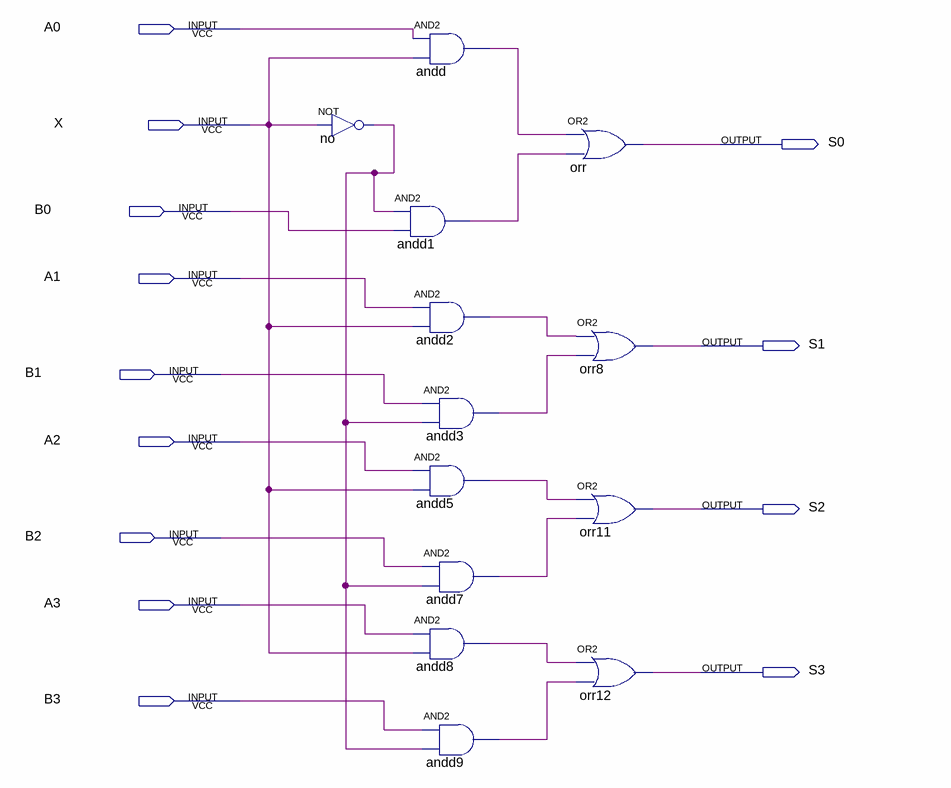
[diagram p0: schematic sheet]
// Quartus schematic MUX8ENTR.bdf as structural Verilog: 13 symbols, 13 pins
module MUX8ENTR (
  input  A0,
  input  X,
  input  B0,
  input  A1,
  input  B1,
  input  A2,
  input  B2,
  input  A3,
  input  B3,
  output S0,
  output S1,
  output S2,
  output S3
);

  wire andd1_out, andd2_out, andd3_out, andd5_out, andd7_out, andd8_out, andd9_out, andd_out, no_out;

  not no (no_out, X);
  and andd (andd_out, A0, X);
  and andd1 (andd1_out, no_out, B0);
  and andd2 (andd2_out, A1, X);
  and andd3 (andd3_out, B1, no_out);
  and andd5 (andd5_out, A2, X);
  and andd7 (andd7_out, B2, no_out);
  and andd8 (andd8_out, A3, X);
  and andd9 (andd9_out, B3, no_out);
  or orr (S0, andd_out, andd1_out);
  or orr8 (S1, andd2_out, andd3_out);
  or orr11 (S2, andd5_out, andd7_out);
  or orr12 (S3, andd8_out, andd9_out);
endmodule
